# Altium schematic sheet Communication.SchDoc
size A3; SheetNumber: 4; SheetTotal: 5
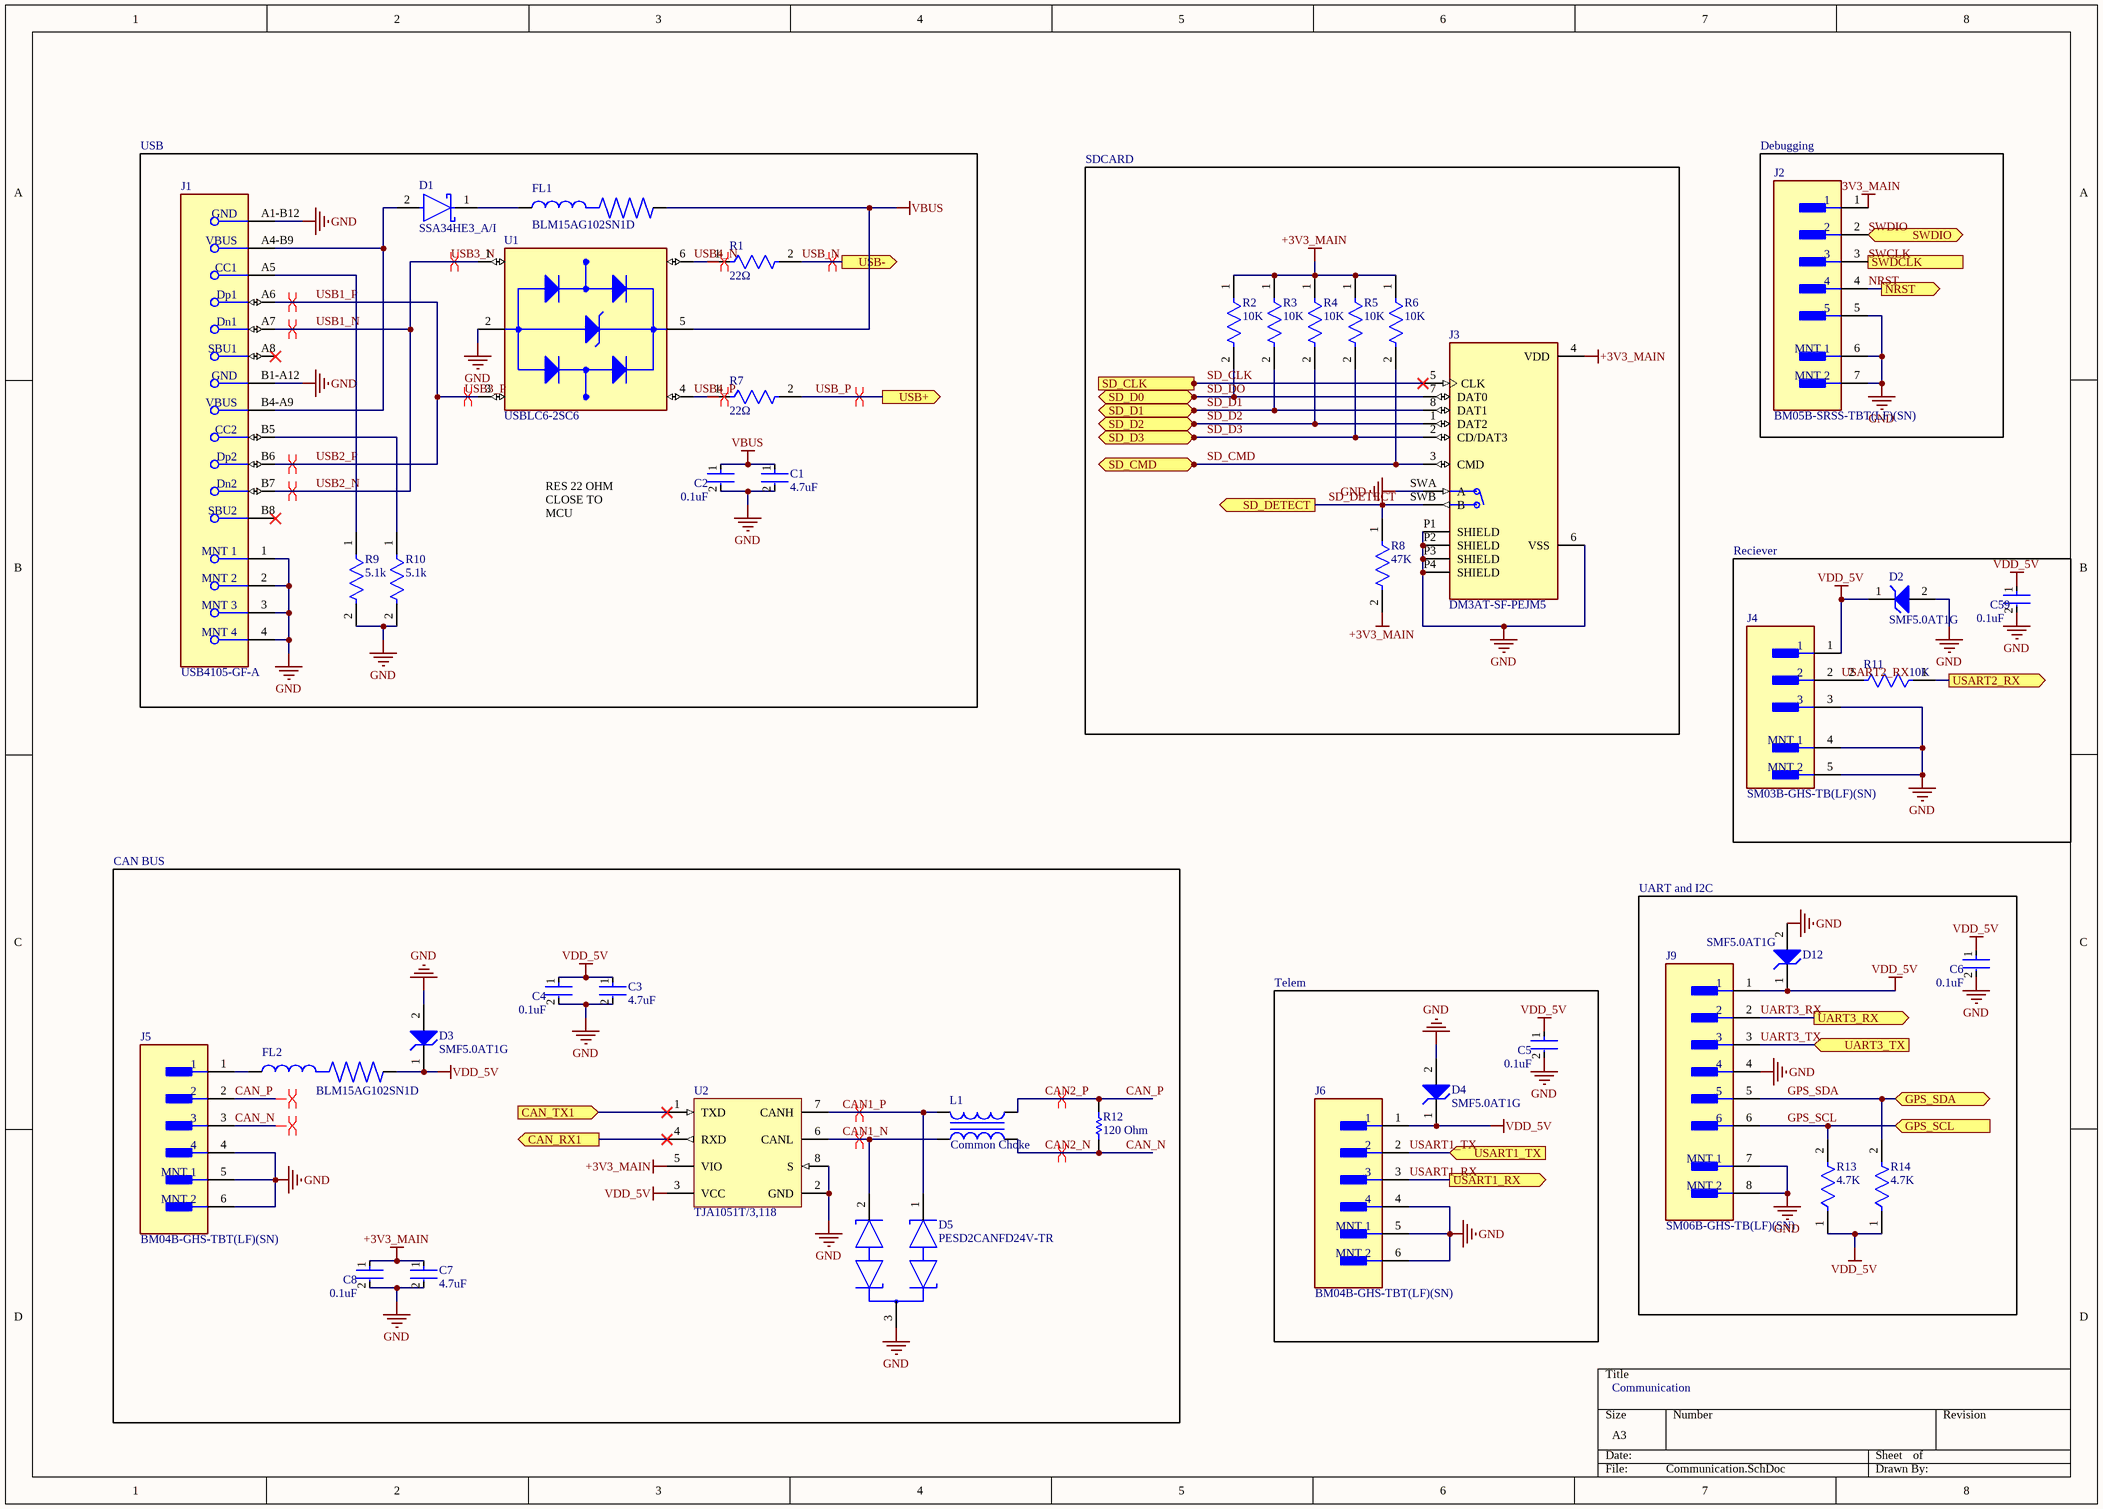
[diagram p0: Communication.SchDoc]

## Parts
C1  4.7uF  [FP-GRT155-0_15-MFG]
C2  0.1uF  [FP-C0402-BB-MFG]
C3  4.7uF  [FP-GRT155-0_15-MFG]
C4  0.1uF  [FP-C0402-BB-MFG]
C5  0.1uF  [FP-C0402-BB-MFG]
C6  0.1uF  [FP-C0402-BB-MFG]
C7  4.7uF  [FP-GRT155-0_15-MFG]
C8  0.1uF  [FP-C0402-BB-MFG]
C59  0.1uF  [FP-C0402-BB-MFG]
D1  SSA34HE3_A/I  [FP-95400-MFG]
D2  SMF5.0AT1G  [ONSC-SOD-123FL-2-498_V]
D3  SMF5.0AT1G  [ONSC-SOD-123FL-2-498_V]
D4  SMF5.0AT1G  [ONSC-SOD-123FL-2-498_V]
D5  PESD2CANFD24V-TR  [FP-SOT23-IPC_A]
D12  SMF5.0AT1G  [ONSC-SOD-123FL-2-498_V]
FL1  BLM15AG102SN1D  [BEADC1005X55N]
FL2  BLM15AG102SN1D  [BEADC1005X55N]
J1  USB4105-GF-A  [FP-USB4105-GF-A-MFG]
J2  BM05B-SRSS-TBT(LF)(SN)  [FP-BM05B-SRSS-TBT_LF_SN-MFG]
J3  DM3AT-SF-PEJM5  [HRS_DM3AT-SF-PEJM5]
J4  SM03B-GHS-TB(LF)(SN)  [FP-SM03B-GHS-TB_LF_SN-MFG]
J5  BM04B-GHS-TBT(LF)(SN)  [FP-BM04B-GHS-TBT_LF_SN-MFG]
J6  BM04B-GHS-TBT(LF)(SN)  [FP-BM04B-GHS-TBT_LF_SN-MFG]
J9  SM06B-GHS-TB(LF)(SN)  [FP-SM06B-GHS-TB_LF_SN-MFG]
L1  Common Choke  [TDK-ACT45B-510-2P-TL003-4_V]
R1  22Ω  [FP-RMCF0402-MFG]
R2  10K  [FP-MCS0402-MFG]
R3  10K  [FP-MCS0402-MFG]
R4  10K  [FP-MCS0402-MFG]
R5  10K  [FP-MCS0402-MFG]
R6  10K  [FP-MCS0402-MFG]
R7  22Ω  [FP-RMCF0402-MFG]
R8  47K  [FP-CRCW0402-e3-IPC_B]
R9  5.1k  [FP-RN73R1E-IPC_C]
R10  5.1k  [FP-RN73R1E-IPC_C]
R11  10K  [FP-MCS0402-MFG]
R12  120 Ohm  [RESC1005X40X25NL05T10]
R13  4.7K  [FP-CRCW0402-Pe3-IPC_C]
R14  4.7K  [FP-CRCW0402-Pe3-IPC_C]
U1  USBLC6-2SC6  [SOT95P280X145-6N]
U2  TJA1051T/3,118  [NXP-SOIC-8_L]

## Blocks framed on the sheet
USB: C1 C2 D1 FL1 J1 R1 R7 R9 R10 U1
SDCARD: J3 R2-R6 R8
Debugging: J2
Reciever: C59 D2 J4 R11
CAN BUS: C3 C4 C7 C8 D3 D5 FL2 J5 L1 R12 U2
Telem: C5 D4 J6

## Ports
CAN_RX1 (out, see EMP_FC_Main[2B], MCU_Core[1A]), CAN_TX1 (in, see EMP_FC_Main[2B], MCU_Core[1A]), GPS_SCL (in, see EMP_FC_Main[3A], MCU_Core[5B]), GPS_SDA (bidir, see EMP_FC_Main[3A], MCU_Core[5B]), NRST (out, see EMP_FC_Main[3B], MCU_Core[1B]), SD_CLK (in, see EMP_FC_Main[2B], MCU_Core[4C]), SD_CMD (bidir, see EMP_FC_Main[2B], MCU_Core[1A]), SD_D0 (bidir, see EMP_FC_Main[2B], MCU_Core[4B]), SD_D1 (bidir, see EMP_FC_Main[2B], MCU_Core[4B]), SD_D2 (bidir, see EMP_FC_Main[2B], MCU_Core[4C]), SD_D3 (bidir, see EMP_FC_Main[2B], MCU_Core[4C]), SD_DETECT (out, see EMP_FC_Main[2B], MCU_Core[4C]), SWDCLK (out, see EMP_FC_Main[3B], MCU_Core[4B]), SWDIO (bidir, see EMP_FC_Main[3B], MCU_Core[4B]), UART3_RX (out, see EMP_FC_Main[2B], MCU_Core[1B]), UART3_TX (in, see EMP_FC_Main[2B], MCU_Core[1A]), USART1_RX (out, see EMP_FC_Main[3B], MCU_Core[4B]), USART1_TX (in, see EMP_FC_Main[3B], MCU_Core[4B]), USART2_RX (out, see EMP_FC_Main[3A], MCU_Core[1A]), USB+ (out, see EMP_FC_Main[3B], MCU_Core[4B]), USB- (out, see EMP_FC_Main[3B], MCU_Core[4B])

## Nets
+3V3_MAIN: C7.1 C8.1 J2.1 J3.4(VDD) R2.1 R3.1 R4.1 R5.1 R6.1 R8.2 U2.5(VIO)
GND: C1.2 C2.2 C3.2 C4.2 C5.2 C6.2 C7.2 C8.2 C59.2 D2.2(A) D3.2(A) D4.2(A) D5.3(CC) D12.2(A) J1.1(MNT_1) J1.2(MNT_2) J1.3(MNT_3) J1.4(MNT_4) J1.A1-B12(GND) J1.B1-A12(GND) J2.5 J2.6(MNT_1) J2.7(MNT_2) J3.6(VSS) J3.P1(SHIELD) J3.P2(SHIELD) J3.P3(SHIELD) J3.P4(SHIELD) J3.SWA(A) J4.3 J4.4(MNT_1) J4.5(MNT_2) J5.4 J5.5(MNT_1) J5.6(MNT_2) J6.4 J6.5(MNT_1) J6.6(MNT_2) J9.4 J9.7(MNT_1) J9.8(MNT_2) R9.2 R10.2 U1.2(GND) U2.2(GND) U2.8(S)
VBUS: C1.1 C2.1 FL1.2 U1.5(VBUS)
VDD_5V: C3.1 C4.1 C5.1 C6.1 C59.1 D2.1(K) D3.1(K) D4.1(K) D12.1(K) FL2.2 J4.1 J6.1 J9.1 R13.1 R14.1 U2.3(VCC)
CAN1_N: D5.2(K2) L1.2 U2.6(CANL)
CAN1_P: D5.1(K1) L1.1 U2.7(CANH)
CAN2_N: J5.3 L1.3 R12.1  [also labelled CAN_N]
CAN2_P: J5.2 L1.4 R12.2  [also labelled CAN_P]
CAN_RX1: U2.4(RXD) ; port CAN_RX1
CAN_TX1: U2.1(TXD) ; port CAN_TX1
GPS_SCL: J9.6 R13.2 ; port GPS_SCL
GPS_SDA: J9.5 R14.2 ; port GPS_SDA
NRST: J2.4 ; port NRST
SD_CLK: J3.5(CLK) ; port SD_CLK
SD_CMD: J3.3(CMD) R6.2 ; port SD_CMD
SD_D1: J3.8(DAT1) R3.2 ; port SD_D1
SD_D2: J3.1(DAT2) R4.2 ; port SD_D2
SD_D3: J3.2(CD/DAT3) R5.2 ; port SD_D3
SD_DETECT: J3.SWB(B) R8.1 ; port SD_DETECT
SD_DO: J3.7(DAT0) R2.2 ; port SD_D0
SWCLK: J2.3 ; port SWDCLK
SWDIO: J2.2 ; port SWDIO
UART3_RX: J9.2 ; port UART3_RX
UART3_TX: J9.3 ; port UART3_TX
USART1_RX: J6.3 ; port USART1_RX
USART1_TX: J6.2 ; port USART1_TX
USART2_RX: R11.1 ; port USART2_RX
USART2_RX: J4.2 R11.2  [a separate net that carries the same name]
USB1_N: J1.A7(Dn1) J1.B7(Dn2) U1.1(I/O1_IN)  [also labelled USB2_N, USB3_N]
USB1_P: J1.A6(Dp1) J1.B6(Dp2) U1.3(I/O2_IN)  [also labelled USB2_P, USB3_P]
USB4_N: R1.1 U1.6(I/O1_OUT)
USB4_P: R7.1 U1.4(I/O2_OUT)
USB_N: R1.2 ; port USB-
USB_P: R7.2 ; port USB+
NetD1_1: D1.1(C) FL1.1
NetD1_2: D1.2(A) J1.A4-B9(VBUS) J1.B4-A9(VBUS)
NetFL2_1: FL2.1 J5.1
NetJ1_A5: J1.A5(CC1) R9.1
NetJ1_B5: J1.B5(CC2) R10.1

Not connected (* = marked no-connect by the designer): J1 A8(SBU1)* B8(SBU2)*

## Layout directives
differential pair: CAN1_N, CAN1_P, CAN2_N, CAN2_P, USB1_N, USB1_P, USB4_N, USB4_P, USB_N, USB_P

## Notes on the sheet
- RES 22 OHM CLOSE TO MCU
- UART and I2C
- Communication

## Library data of the parts
C1 C3 C7 = CMP-06035-058540-1: Multi-Layer Ceramic Capacitor 4.7uF 10V X5R ±20% 0402 Paper T/R
C2 C4-C6 C8 C59 = CMP-03020-002733-1: CAP CER 0.1UF 10V X7R 0402; Manufacturer: Kemet; Manufacturer Part Number: C0402C104K8RACAUTO; Material: Ceramic; Value: 0.10 μF; Tolerance: 0.1; Temperature Coefficient: 15%; ComponentLink2Description: Datasheet; Automotive: No; Digikey Description: CAP CER 0.1UF 10V X7R 0402; Temperature Range Low: -55°C; Ipc Land Pattern Name: CAPC10050X50; Lead Free: Yes; Category: Cap; Package: C0402-BB; Octopart: https://octopart.com/c0402c104k8racauto-kemet-9145167; Voltage Rating: 10 V; Device Class L2: Capacitors; Capacitance: 0.10 μF; Temperature Range High: +125°C; Height: 0.55mm; ComponentLink2URL: https://content.kemet.com/datasheets/KEM_C1002_X7R_SMD.pdf; Temperature: -55°C to +125°C; Device Class L1: Passive Components; Temperature Characteristic: X7R; RoHS: TRUE; Device Class L3: Ceramic Capacitors
D1 = CMP-02539-000063-1: DIODE SCHOTTKY 40V 3A DO214AC; Forward Voltage: 380mV; Peak Non-Repetitive Surge Current: 75A; Element Configuration: Single; Max Reverse Current: 17mA; Radiation Hardening: No; Max Operating Temperature: 150°C; Min Operating Temperature: -65°C; Packaging: Tape and Reel; Case/Package: DO-214AC; Forward Current: 3A; Series: Automotive, AEC-Q101; Max Repetitive Reverse Voltage (Vrrm): 40V; Average Rectified Current: 3A; Mount: Surface Mount; Reverse Voltage (DC): 40V; Package Quantity: 7500; RoHS Compliant: Yes; Max Reverse Voltage (DC): 40V; Max Forward Surge Current (Ifsm): 75A
D2-D4 D12 = CMP-1061-00612-1: 200 W Transient Voltage Suppressor, 2-Pin SOD-123FL, Pb-Free, Tape and Reel; Manufacturer: On Semiconductor; Direction: Unidirectional; IR Max (uA): 400; V(BR) Typ (V): 6.7; PackageDescription: 2-Pin SOD, Body 1.65 x 2.7 mm; PartNumber: SMF5.0AT1G; ComponentLink3Description: Package Specification; ComponentLink3URL: http://www.onsemi.com/pub_link/Collateral/498-01.PDF; PackageVersion: Rev. D, 05/2013; Mounting Technology: Surface Mount; PackageReference: SOD-123FL-2-498; ComponentLink2URL: http://www.onsemi.com/pub_link/Collateral/SMF5.0AT1-D.PDF; DatasheetVersion: Rev. 7; ComponentLink1Description: Manufacturer URL; Packing: Tape and Reel; RoHS: Pb-Free; ComponentLink1URL: http://www.onsemi.com/; ComponentLink2Description: Datasheet
D5 = CMP-14436-000014-1: TVS DIODE 24VWM 42VC TO236AB
FL1 FL2 = BLM15AG102SN1D: MF: Murata; Package: None; Price: None; Value: *; MP: BLM15AG102SN1D; Availability: Unavailable
J1 = CMP-245163-000001-1: CONN RCPT USB2.0 TYPEC 5A; Manufacturer: GCT; Voltage Rating: 20V; Is Female: yes; Current Rating: 5/6.25/1.25/0.25A; Number Of Contacts: 16; Conn Orientation: Right Angle; Device Class L1: Connectors; Category: Conn; Lead Free: Yes; RoHS: TRUE; Temperature Range High: +85°C; Digikey Description: CONN RCPT USB2.0 TYPEC 5A; Device Class L3: unset; ComponentLink2Description: Datasheet; Manufacturer Part Number: USB4105-GF-A; Package: 0; Usb Standard: USB 2.0; Device Class L2: USB Connectors; Automotive: No; Temperature Range Low: -40°C; Height: 3.46mm; Temperature: -40°C to +85°C; Contact Material: Gold,Nickel; ComponentLink2URL: https://gct.co/files/drawings/usb4105.pdf; Octopart: https://octopart.com/usb4105-gf-a-gct-106627878
J2 = CMP-17439-000266-1: CONN HEADER SMD 5POS 1MM; Voltage Rating: 50V; Number of Positions: 5; Mated Stacking Heights: 4.9mm; Pitch: 0.039inch; Connector Type: Header; Insulation Material: Nylon; Contact Material: Copper Alloy; Termination: Solder; Insulation Color: Natural; Color: Natural; Number of Rows: 1; Series: SR; Lead Free: Lead Free; Mount: Surface Mount; Package Quantity: 1500; Fastening Type: Pull; Max Operating Temperature: 85°C; Contact Shape: Square; Contact Type: Male Pin; Min Operating Temperature: -25°C; Contact Plating: Tin; Flammability Rating: UL94 V-0; Packaging: Cut Tape; Contact Finish - Mating: TIN
J3 = DM3AT-SF-PEJM5: 10 (8 + 2) Position Card Connector Secure Digital - microSDâ„¢ Surface Mount, Right Angle Gold; MF: Hirose; SnapEDA_Link: https://www.snapeda.com/parts/DM3AT-SF-PEJM5/Hirose+Electric+Co+Ltd/view-part/?ref=snap; Package: None; Value: *; MP: DM3AT-SF-PEJM5; Check_prices: https://www.snapeda.com/parts/DM3AT-SF-PEJM5/Hirose+Electric+Co+Ltd/view-part/?ref=eda
J4 = CMP-17439-000068-1: CONN HEADER SMD R/A 3POS 1.25MM; Voltage Rating: 50V; Wire/Cable Gauge: 26AWG; Pitch: 0.049inch; Gender: Male; Number of Positions: 3; Current Rating: 1A; Orientation: Right Angle; REACH SVHC: No SVHC; Insulation Color: Natural; Housing Material: Nylon; Mount: Surface Mount; Flammability Rating: UL94 V-0; Color: Natural; Number of Rows: 1; Housing Color: Natural; Termination: Solder; Voltage Rating (AC): 50V; Max Operating Temperature: 85°C; Connector Type: Header; Series: GH; Packaging: Tape and Reel; Contact Finish - Mating: TIN; Lead Free: Lead Free; Fastening Type: Ramp; Contact Plating: Tin; Contact Material: Bronze; Insulation Material: Nylon; Contact Type: Outer Shroud Contact; Number of Contacts: 3; Min Operating Temperature: -25°C; Contact Shape: Rectangular
J5 J6 = CMP-17439-000062-2: CONN HEADER SMD 4POS 1.25MM; Number of Positions: 4; Wire/Cable Gauge: 26AWG; Current Rating: 1A; Voltage Rating (AC): 50V; Gender: Male; Orientation: Straight; Max Operating Temperature: 85°C; Pitch: 1.25mm; Contact Plating: Tin; Number of Rows: 4; Series: GH; Min Operating Temperature: -25°C; REACH SVHC: No SVHC; Packaging: Cut Tape; Lead Free: Lead Free; Voltage Rating: 50V; Contact Material: Bronze; Number of Contacts: 4; Termination: Crimp; Case/Package: SMD/SMT; Housing Color: Natural; Housing Material: Nylon
J9 = CMP-17439-000061-1: CONN HEADER SMD R/A 6POS 1.25MM; Number of Contacts: 6; Voltage Rating: 50V; Current Rating: 1A; Connector Type: Outer Shroud Contact; Contact Resistance: 50mR; Orientation: Right Angle; Max Operating Temperature: 85°C; Mount: Surface Mount; Packaging: Tape and Reel; Contact Plating: Tin; Depth: 4.05mm; Max Voltage Rating (AC): 50V; Lead Free: Lead Free; Pitch: 1.25mm; Number of Positions: 6; Max Current Rating: 1A; Termination: Solder; Min Operating Temperature: -25°C; Housing Color: Beige; Fastening Type: Ramp; Length: 10.75mm; Color: Natural; Contact Material: Bronze; Housing Material: Polyamide; Number of Rows: 1
L1 = CMP-2000-05391-1: Common-Mode Choke for CAN Bus System, 51uH, 50 V DC, -40 to 150 degC, 4-Pin SMD, RoHS, Tape and Reel; Manufacturer: TDK; Number of Lines: 2; Impedance: 2.8kOhm; Current: 200mA; Featured Product: FerriteChipCommon-ModeFilterforCAN-BUSSystem; Inductance: 51µH; Other Names: 445-3958-6; Filter Type: Data,SignalLine; DC Resistance (DCR): 1OhmMax; Dynamic Catalog: ACTSeries; Other Drawings: ACM3225SeriesSchematic / ACT45B-xxx-2P_Footprint; Catalog Drawings: (ACM4532,ACT45B)-xxx-2P_Top / ACT45B-xxx-2P_Side / ACT45B-xxx-2P_Bottom; Package / Case: Horizontal,4PCPad; Family: CommonModeChokes; Datasheet Version: Aug-12; Height (Max): 0.118"(3.00mm); Packaging: Digi-Reel; Category: Filters; Datasheet URL: https://datasheet.ciiva.com/22726/1649098-22726290.pdf; Mounting Type: SurfaceMount; Operating Temperature: -40degC~150degC; Size / Dimension: 0.177"Lx0.126"W(4.50mmx3.20mm); Series: ACT; Manufacturer URL: http://www.tdk.com/; Standard Package: 1
R1 R7 = CMP-26527-006952-1: 22Ω ±1% 0.063W 0402 Thick Film Chip Resistor AEC-Q200 compliant; Temperature Coefficient: 100ppm/°C; Resistance: 22R; Max Power Dissipation: 63mW; RoHS Compliant: Yes; Min Operating Temperature: -55°C; Features: Automotive AEC-Q200; Max Operating Temperature: 155°C; Number of Terminations: 2; Length: 0.039inch; Height: 0.016inch; Tolerance: 1%; Packaging: Tape and Reel; Width: 0.02inch; Resistor Type: Thick Film; Contact Plating: Tin; Case/Package: 0402; Series: RMCF; Mount: Surface Mount
R2-R6 R11 = CMP-02407-000363-1: RES SMD 1.2K OHM 1% 1/10W 0402; Power Rating: 100mW; Temperature Coefficient: 25ppm/°C; Tolerance: 0.5%; Voltage Rating: 50V; Resistance: 10kR; Package Quantity: 10000; Case Code (Metric): 1005; Height: 0.015inch; Termination: SMD/SMT; Features: Automotive AEC-Q200; Packaging: Tape and Reel; Length: 0.039inch; Min Operating Temperature: -55°C; Case/Package: 0402; Max Power Dissipation: 100mW; Case Code (Imperial): 0402; Width: 0.5mm; Contact Plating: Tin; Weight: 2.1E-05oz; Max Operating Temperature: 175°C; Composition: Thin Film; Number of Terminations: 2; Radiation Hardening: No
R8 = CMP-02407-007381-1: RES Thick Film, 47kΩ, 1%, 0.063W, 100ppm/°C, 0402; Max Power Dissipation: 63mW; Resistance: 47kR; Case/Package: 0402; Contact Plating: Tin; Composition: Thick Film; Height: 0.016inch; Radiation Hardening: No; Tolerance: 1%; Length: 0.039inch; Features: Automotive AEC-Q200; Max Operating Temperature: 155°C; Temperature Coefficient: 100ppm/°C; Number of Terminations: 2; Packaging: Tape and Reel; Width: 0.02inch; Package Quantity: 50000; Min Operating Temperature: -55°C; Lead Free: Lead Free
R9 R10 = CMP-04015-008529-1: 5.1kΩ ±1% 0.063W, 1/16W Chip Resistor 0402 (1005 Metric) Moisture Resistant Thin Film
R12 = CMP-2002-07370-1: Manufacturer: Yageo / Phycomp; Part Number: RC0402FR-07120RL
R13 R14 = CMP-03613-000096-1: RES Thick Film, 4.7kΩ, 1%, 0.063W, 50ppm/°C, 0402; Resistance: 4.7kR; Max Power Dissipation: 63mW; Tolerance: 1%; Package Quantity: 10000; Case/Package: 0402; Max Operating Temperature: 155°C; RoHS Compliant: Yes; Series: CRCW-P; Resistor Type: Thick Film; Number of Terminations: 2; Min Operating Temperature: -55°C; Temperature Coefficient: 50ppm/°C; Features: Automotive AEC-Q200; Length: 0.039inch; Height: 0.016inch; Width: 0.02inch; Packaging: Tape and Reel
U1 = USBLC6-2SC6: 17V Clamp 5A (8/20Âµs) Ipp Tvs Diode Surface Mount SOT-23-6; MF: STMicroelectronics; Value: *; SnapEDA_Link: https://www.snapeda.com/parts/USBLC6-2SC6/STMicroelectronics/view-part/?ref=snap; Check_prices: https://www.snapeda.com/parts/USBLC6-2SC6/STMicroelectronics/view-part/?ref=eda; Purchase-URL: https://pricing.snapeda.com/search/part/USBLC6-2SC6/?ref=eda; Price: None; Availability: In Stock; Package: SOT-23-6 STMicroelectronics; MP: USBLC6-2SC6
U2 = CMP-2000-07245-1: High-Speed CAN Transceiver, 3 to 5 V, 8-Pin SOIC (SOT96-1), RoHS, Tape and Reel; Manufacturer: NXP; Power Down Mode: Normal/Silent; Rad Hardened: No; Number of Transceivers: 1; Supply Current: 70mA; Operating Supply Voltage (Max): 5.5V; Operating Supply Voltage (Typ): 5V; Operating Supply Voltage (Min): 4.5V; Standard Supported: ISO11898-2; Data Rate: 1Mbps; DELETED: Compliant; Operating Temperature (Min): -40C; Datasheet Version: Rev. 7, 01/2015; Pin Count: 8; Operating Temperature (Max): 125C; Package Description: 8-Pin Small Outline Integrated Circuit, Body 4.9 x 3.9 mm, Pitch 1.27 mm; Category: Transceiver; Packaging: TapeandReel; Mounting: SurfaceMount; Package Reference: SOT96-1; Operating Temperature Classification: Automotive; Mounting Technology: SurfaceMount; Package Type: SO; Manufacturer URL: http://www.nxp.com/; Datasheet URL: http://www.nxp.com/documents/data_sheet/TJA1051.pdf